# Altium schematic sheet NEW_MINI.SchDoc
size A4
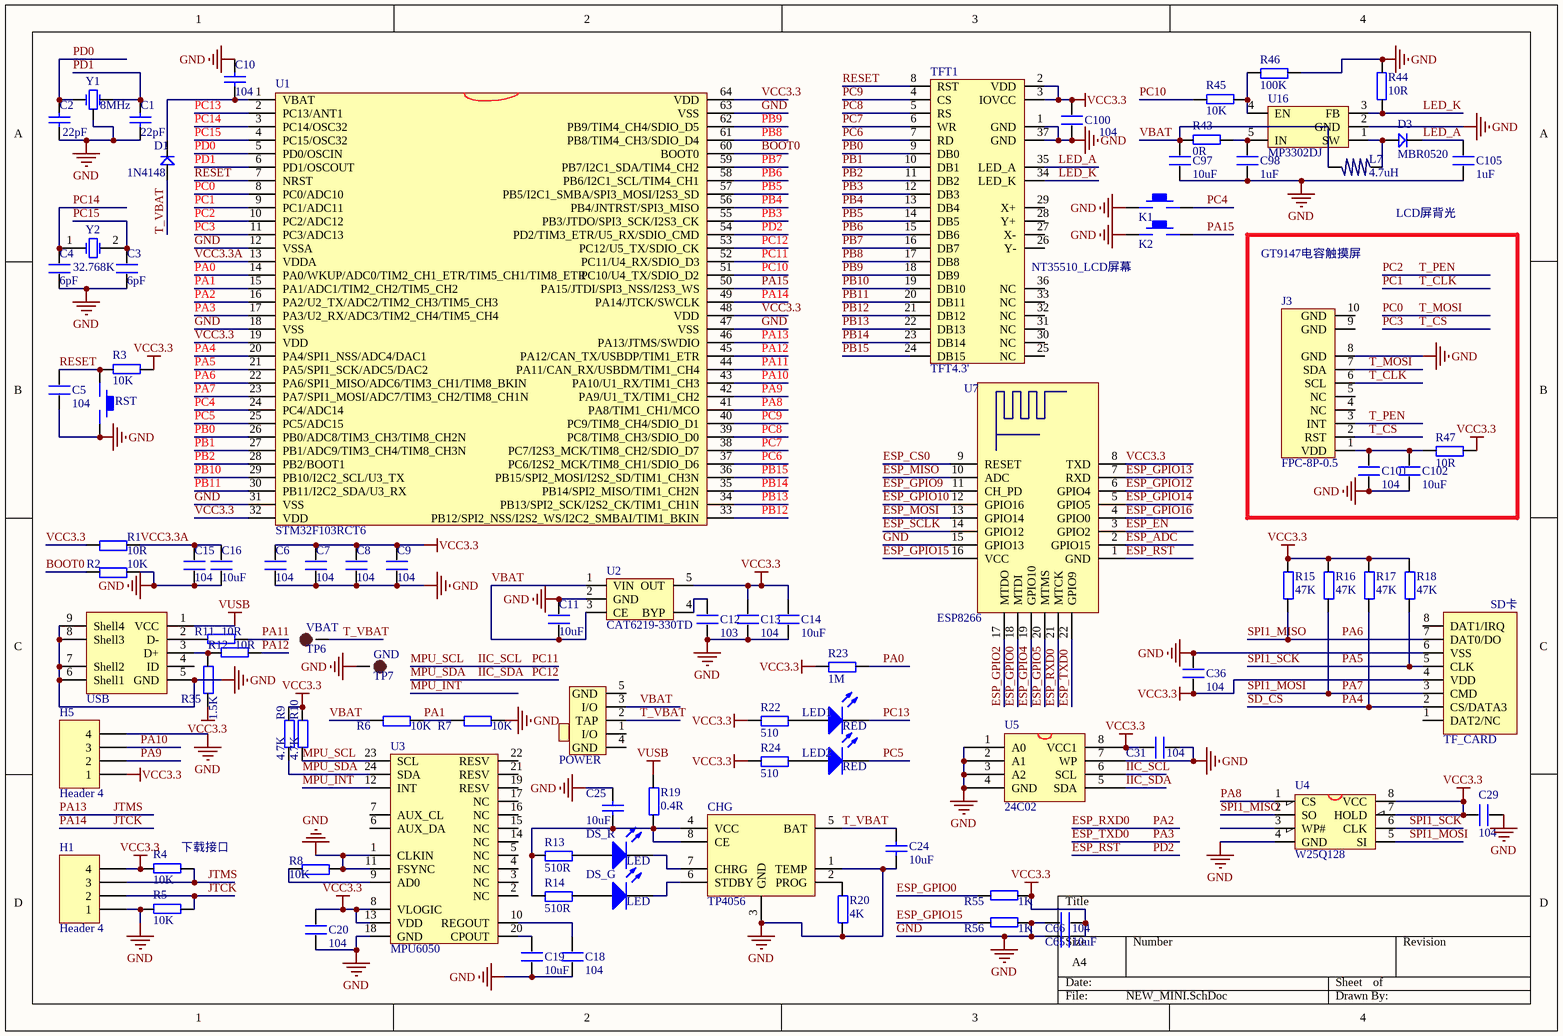
[diagram p0: NEW_MINI.SchDoc]

## Parts
C1  22pF  [C 0603_M]
C2  22pF  [C 0603_M]
C3  6pF  [C 0603_M]
C4  6pF  [C 0603_M]
C5  104  [C 0603_M]
C6  104  [C 0603_M]
C7  104  [C 0603_M]
C8  104  [C 0603_M]
C9  104  [C 0603_M]
C10  104  [C 0603_M]
C11  10uF  [C 0603_M]
C12  103  [C 0603_M]
C13  104  [C 0603_M]
C14  10uF  [C 0603_M]
C15  104  [C 0603_M]
C16  10uF  [C 0603_M]
C18  104  [C 0603_M]
C19  10uF  [C 0603_M]
C20  104  [C 0603_M]
C24  10uF  [C 0603_M]
C25  10uF  [C 0603_M]
C29  104  [C 0603_M]
C31  104  [C 0603_M]
C36  104  [C 0603_M]
C65  10uF  [C 0603_M]
C66  104  [C 0603_M]
C97  10uF  [C 0603_M]
C98  1uF  [C 0603_M]
C100  104  [C 0603_M]
C101  104  [C 0603_M]
C102  10uF  [C 0603_M]
C105  1uF  [C 0603_M]
CHG  TP4056  [SOP8_M]
D1  1N4148  [DIODE_SOP]
D3  MBR0520  [SOD-123]
DS_G  LED  [LED 0805G]
DS_R  LED  [LED 0805R]
GND  TP7  [TP-1.5]
H1  Header 4  [HDR2.54-LI-4P]
H5  Header 4  [HDR2.54-LI-4P]
J3  FPC-8P-0.5  [FPC-8P]
K1  S-KEY-SMD-324225  [KEY-SOP324225]  (value not drawn)
K2  S-KEY-SMD-324225  [KEY-SOP324225]  (value not drawn)
L7  4.7uH  [L_SOP4]
LED1  RED  [LED 0805R]
LED2  RED  [LED 0805R]
POWER  BUTTON_DIP3  [MSK-12C01-07]  (value not drawn)
R1  10R  [R 0603_M]
R2  10K  [R 0603_M]
R3  10K  [R 0603_M]
R4  10K  [R 0603_M]
R5  10K  [R 0603_M]
R6  10K  [R 0603_M]
R7  10K  [R 0603_M]
R8  10K  [R 0603_M]
R9  4.7K  [R 0603_M]
R10  4.7K  [R 0603_M]
R11  10R  [R 0603_M]
R12  10R  [R 0603_M]
R13  510R  [R 0603_M]
R14  510R  [R 0603_M]
R15  47K  [R 0603_M]
R16  47K  [R 0603_M]
R17  47K  [R 0603_M]
R18  47K  [R 0603_M]
R19  0.4R  [R 0603_M]
R20  4K  [R 0603_M]
R22  510  [R 0603_M]
R23  1M  [R 0603_M]
R24  510  [R 0603_M]
R35  1.5K  [R 0603_M]
R43  0R  [R 0603_M]
R44  10R  [R 0603_M]
R45  10K  [R 0603_M]
R46  100K  [R 0603_M]
R47  10R  [R 0603_M]
R55  1K  [R 0603_M]
R56  1K  [R 0603_M]
RST  S-KEY-SMD-324225  [KEY-SOP324225]  (value not drawn)
TF_CARD  SD-MICRO-TF  [SD-MICRO-TF]  (value not drawn)
TFT1  TFT4.3'  [TFT4.3']
U1  STM32F103RCT6  [LQFP_64_M]
U2  CAT6219-330TD  [SOT-23-5]
U3  MPU6050  [QFN24]
U4  W25Q128  [SOIC-8]
U5  24C02  [SOP-8]
U7  ESP8266  [ESP_12E]
U16  MP3302DJ  [SOT-23-5]
USB  J-MICRO-USB-5S  [USB-AB-5S]  (value not drawn)
VBAT  TP6  [TP-1.5]
Y1  8MHz  [Y-XTAL-3215-3P]
Y2  32.768K  [OSC 3215-2P]

## Nets
GND: C1.1 C2.1 C3.1 C4.1 C5.1 C6.1 C7.1 C8.1 C9.1 C10.1 C11.2 C12.1 C13.1 C14.1 C15.1 C16.1 C18.1 C19.1 C20.1 C24.2 C25.2 C29.2 C31.2 C36.2 C65.1 C66.1 C97.1 C98.1 C100.1 C101.1 C102.1 C105.2 CHG.1(TEMP) CHG.3(GND) GND.1 H1.1 H5.4 J3.8(GND) K1.1 K2.1 R2.2 R5.2 R7.2 R8.2 R20.1 R44.1 R46.2 R56.1 RST.2 TF_CARD.6(VSS) TFT1.1(GND) TFT1.37(GND) U1.12(VSSA) U1.18(VSS) U1.31(VSS) U1.47(VSS) U1.63(VSS) U2.2(GND) U3.1(CLKIN) U3.11(FSYNC) U3.18(GND) U4.4(GND) U5.1(A0) U5.2(A1) U5.3(A2) U5.4(GND) U5.7(WP) U7.15(GPIO13) U16.2(GND) USB.5(GND) USB.6(Shell1) USB.7(Shell2) USB.8(Shell3) USB.9(Shell4) Y1.2(GND)
VCC3.3: C6.2 C7.2 C8.2 C9.2 C13.2 C14.2 C20.2 C29.1 C31.1 C36.1 C65.2 C66.2 C100.2 H1.4 H5.1 R1.1 R3.1 R4.2 R9.2 R10.2 R15.2 R16.2 R17.2 R18.2 R22.1 R23.1 R24.1 R35.1 R47.2 R55.1 TF_CARD.4(VDD) TFT1.2(VDD) TFT1.3(IOVCC) U1.19(VDD) U1.32(VDD) U1.48(VDD) U1.64(VDD) U2.5(OUT) U3.8(VLOGIC) U3.13(VDD) U4.7(HOLD) U4.8(VCC) U5.8(VCC1) U7.8(TXD)
VUSB: R19.2 USB.1(VCC)
BOOT0: R2.1 U1.60(BOOT0)
ESP_ADC: U7.2(GPIO15)
ESP_CS0: U7.9(RESET)
ESP_EN: U7.3(GPIO2)
ESP_GPIO0: R55.2 U7.18(MTDI)
ESP_GPIO2: U7.17(MTDO)
ESP_GPIO4: U7.19(GPIO10)
ESP_GPIO5: U7.20(MTMS)
ESP_GPIO9: U7.11(CH_PD)
ESP_GPIO10: U7.12(GPIO16)
ESP_GPIO12: U7.6(GPIO4)
ESP_GPIO13: U7.7(RXD)
ESP_GPIO14: U7.5(GPIO5)
ESP_GPIO15: R56.2 U7.16(VCC)
ESP_GPIO16: U7.4(GPIO0)
ESP_MISO: U7.10(ADC)
ESP_MOSI: U7.13(GPIO14)
ESP_RST: U1.54(PD2/TIM3_ETR/U5_RX/SDIO_CMD) U7.1(GND)  [also labelled PD2]
ESP_RXD0: U1.16(PA2/U2_TX/ADC2/TIM2_CH3/TIM5_CH3) U7.21(MTCK)  [also labelled PA2]
ESP_SCLK: U7.14(GPIO12)
ESP_TXD0: U1.17(PA3/U2_RX/ADC3/TIM2_CH4/TIM5_CH4) U7.22(GPIO9)  [also labelled PA3]
IIC_SCL: R10.1 U1.52(PC11/U4_RX/SDIO_D3) U3.23(SCL) U5.6(SCL)  [also labelled MPU_SCL, PC11]
IIC_SDA: R9.1 U1.53(PC12/U5_TX/SDIO_CK) U3.24(SDA) U5.5(SDA)  [also labelled MPU_SDA, PC12]
JTCK: H1.2 R5.1 U1.49(PA14/JTCK/SWCLK)  [also labelled PA14]
JTMS: H1.3 R4.1 U1.46(PA13/JTMS/SWDIO)  [also labelled PA13]
LED_A: C105.1 D3.2 TFT1.35(LED_A)
LED_K: R44.2 TFT1.34(LED_K) U16.3(FB)
MPU_INT: U3.12(INT)
PA0: R23.2 U1.14(PA0/WKUP/ADC0/TIM2_CH1_ETR/TIM5_CH1/TIM8_ETR)
PA1: R6.2 R7.1 U1.15(PA1/ADC1/TIM2_CH2/TIM5_CH2)
PA4: R17.1 TF_CARD.2(CS/DATA3) U1.20(PA4/SPI1_NSS/ADC4/DAC1)  [also labelled SD_CS]
PA5: R18.1 TF_CARD.5(CLK) U1.21(PA5/SPI1_SCK/ADC5/DAC2) U4.6(CLK)  [also labelled SPI1_SCK]
PA6: R15.1 TF_CARD.7(DAT0/DO) U1.22(PA6/SPI1_MISO/ADC6/TIM3_CH1/TIM8_BKIN) U4.2(SO)  [also labelled SPI1_MISO]
PA7: R16.1 TF_CARD.3(CMD) U1.23(PA7/SPI1_MOSI/ADC7/TIM3_CH2/TIM8_CH1N) U4.5(SI)  [also labelled SPI1_MOSI]
PA8: U1.41(PA8/TIM1_CH1/MCO) U4.1(CS)
PA9: H5.2 U1.42(PA9/U1_TX/TIM1_CH2)
PA10: H5.3 U1.43(PA10/U1_RX/TIM1_CH3)
PA11: R11.1 U1.44(PA11/CAN_RX/USBDM/TIM1_CH4)
PA12: R12.1 U1.45(PA12/CAN_TX/USBDP/TIM1_ETR)
PA15: K2.2 U1.50(PA15/JTDI/SPI3_NSS/I2S3_WS)
PB0: TFT1.9(DB0) U1.26(PB0/ADC8/TIM3_CH3/TIM8_CH2N)
PB1: TFT1.10(DB1) U1.27(PB1/ADC9/TIM3_CH4/TIM8_CH3N)
PB2: TFT1.11(DB2) U1.28(PB2/BOOT1)
PB3: TFT1.12(DB3) U1.55(PB3/JTDO/SPI3_SCK/I2S3_CK)
PB4: TFT1.13(DB4) U1.56(PB4/JNTRST/SPI3_MISO)
PB5: TFT1.14(DB5) U1.57(PB5/I2C1_SMBA/SPI3_MOSI/I2S3_SD)
PB6: TFT1.15(DB6) U1.58(PB6/I2C1_SCL/TIM4_CH1)
PB7: TFT1.16(DB7) U1.59(PB7/I2C1_SDA/TIM4_CH2)
PB8: TFT1.17(DB8) U1.61(PB8/TIM4_CH3/SDIO_D4)
PB9: TFT1.18(DB9) U1.62(PB9/TIM4_CH4/SDIO_D5)
PB10: TFT1.19(DB10) U1.29(PB10/I2C2_SCL/U3_TX)
PB11: TFT1.20(DB11) U1.30(PB11/I2C2_SDA/U3_RX)
PB12: TFT1.21(DB12) U1.33(PB12/SPI2_NSS/I2S2_WS/I2C2_SMBAI/TIM1_BKIN)
PB13: TFT1.22(DB13) U1.34(PB13/SPI2_SCK/I2S2_CK/TIM1_CH1N)
PB14: TFT1.23(DB14) U1.35(PB14/SPI2_MISO/TIM1_CH2N)
PB15: TFT1.24(DB15) U1.36(PB15/SPI2_MOSI/I2S2_SD/TIM1_CH3N)
PC0: J3.7(SDA) U1.8(PC0/ADC10)  [also labelled T_MOSI]
PC1: J3.6(SCL) U1.9(PC1/ADC11)  [also labelled T_CLK]
PC2: J3.3(INT) U1.10(PC2/ADC12)  [also labelled T_PEN]
PC3: J3.2(RST) U1.11(PC3/ADC13)  [also labelled T_CS]
PC4: K1.2 U1.24(PC4/ADC14)
PC5: LED2.2(K) U1.25(PC5/ADC15)
PC6: TFT1.7(RD) U1.37(PC6/I2S2_MCK/TIM8_CH1/SDIO_D6)
PC7: TFT1.6(WR) U1.38(PC7/I2S3_MCK/TIM8_CH2/SDIO_D7)
PC8: TFT1.5(RS) U1.39(PC8/TIM8_CH3/SDIO_D0)
PC9: TFT1.4(CS) U1.40(PC9/TIM8_CH4/SDIO_D1)
PC10: R45.2 U1.51(PC10/U4_TX/SDIO_D2)
PC13: LED1.2(K) U1.2(PC13/ANT1)
PC14: C4.2 U1.3(PC14/OSC32) Y2.1(OSC1)
PC15: C3.2 U1.4(PC15/OSC32) Y2.2(OSC2)
PD0: C2.2 U1.5(PD0/OSCIN) Y1.1(OSC1)
PD1: C1.2 U1.6(PD1/OSCOUT) Y1.3(OSC2)
RESET: C5.2 R3.2 RST.1 TFT1.8(RST) U1.7(NRST)
T_VBAT: C24.1 CHG.5(BAT) D1.1 POWER.2(TAP) VBAT.1
VBAT: C11.1 C97.2 L7.2 POWER.3(I/O) R6.1 R43.2 U2.1(VIN) U2.3(CE)
VCC3.3A: C15.2 C16.2 R1.2 U1.13(VDDA)
NetC10_2: C10.2 D1.2 U1.1(VBAT)
NetC12_2: C12.2 U2.4(BYP)
NetC18_2: C18.2 U3.10(REGOUT)
NetC19_2: C19.2 U3.20(CPOUT)
NetC25_1: C25.1 CHG.4(VCC) CHG.8(CE) R13.1 R14.1 R19.1
NetC98_2: C98.2 R43.1 U16.5(IN)
NetC101_2: C101.2 C102.2 J3.1(VDD) R47.1
NetCHG_2: CHG.2(PROG) R20.2
NetCHG_6: CHG.6(STDBY) DS_G.2(K)
NetCHG_7: CHG.7(CHRG) DS_R.2(K)
NetD3_1: D3.1 L7.1 U16.1(SW)
NetDS_G_1: DS_G.1(A) R14.2
NetDS_R_1: DS_R.1(A) R13.2
NetLED1_1: LED1.1(A) R22.2
NetLED2_1: LED2.1(A) R24.2
NetR8_1: R8.1 U3.9(AD0)
NetR11_2: R11.2 USB.2(D-)
NetR12_2: R12.2 R35.2 USB.3(D+)
NetR45_1: R45.1 R46.1 U16.4(EN)

Not connected (* = marked no-connect by the designer): J3 4(NC) 5(NC) 9(GND) 10(GND); POWER 1(I/O) 4(GND) 5(GND); TF_CARD 1(DAT2/NC) 8(DAT1/IRQ); TFT1 25(NC) 26(Y-) 27(X-) 28(Y+) 29(X+) 30(NC) 31(NC) 32(NC) 33(NC) 36(NC); U3 2(NC) 3(NC) 4(NC) 5(NC) 6(AUX_DA) 7(AUX_CL) 14(NC) 15(NC) 16(NC) 17(NC) 19(RESV) 21(RESV) 22(RESV); U4 3(WP#); USB 4(ID)

## Notes on the sheet
- LCD屏背光
- (near TFT1) NT35510_LCD屏幕
- GT9147电容触摸屏
- (near TF_CARD) SD卡
- (near R4) 下载接口

## Library data of the parts
C1 C2 C10 C24 C25 = CAP
C3-C9 C11-C16 C18-C20 C29 C31 C36 C65 C66 C97 C98 C100-C102 C105 = C
CHG = Component_1
D1 = D
D3 = D: 1N4148
DS_G DS_R LED1 LED2 = LED2: Typical RED, GREEN, YELLOW, AMBER GaAs LED; Published: 8-Jun-2000; LatestRevisionDate: 17-Jul-2002; LatestRevisionNote: Re-released for DXP Platform.; PackageDocument: Feb-2002; PackageReference: 3.2X1.6X1.1; Publisher: Altium Limited
GND VBAT = TEST-POINT: 测试点
H1 H5 = Header 4: Header, 4-Pin; LatestRevisionDate: 17-Jul-2002; LatestRevisionNote: Re-released for DXP Platform.; Publisher: Altium Limited
J3 = FPC-8: FPC-8P-0.5mm
K1 K2 RST = S-KEY-SMD-324225: KEY,SMD,324225
L7 = L
POWER = BUTTON_DIP3: 拨动开关SS-12F44
R1-R20 R22-R24 R35 R43-R47 R55 R56 = R
TF_CARD = SD-MICRO-TF: SD,MICRO,TF
TFT1 = TFT4.3‘: 4.3寸,电容/电阻触摸,分辨率:480*800
U1 = STM32F103RDT6
U2 = CAT6219-330TD: 3.3V 500mA LDO
U3 = MPU6050: 9轴运动处理传感器
U4 = W25X16: W25X16;SST25VF016;MX25L1605
U5 = 24C256
U16 = MP3302: LCD背光IC
USB = J-MICRO-USB-5S: Micro USB 5.9有柱脚长1.25加长针
Y1 = Y-3215-8M: XTAL,3215,8MHz
Y2 = XTAL: Crystal Oscillator; Published: 8-Jun-2000; LatestRevisionDate: 17-Jul-2002; LatestRevisionNote: Re-released for DXP Platform.; Publisher: Altium Limited